# EAGLE design PRY417 Med (EAGLE 9.1.3)
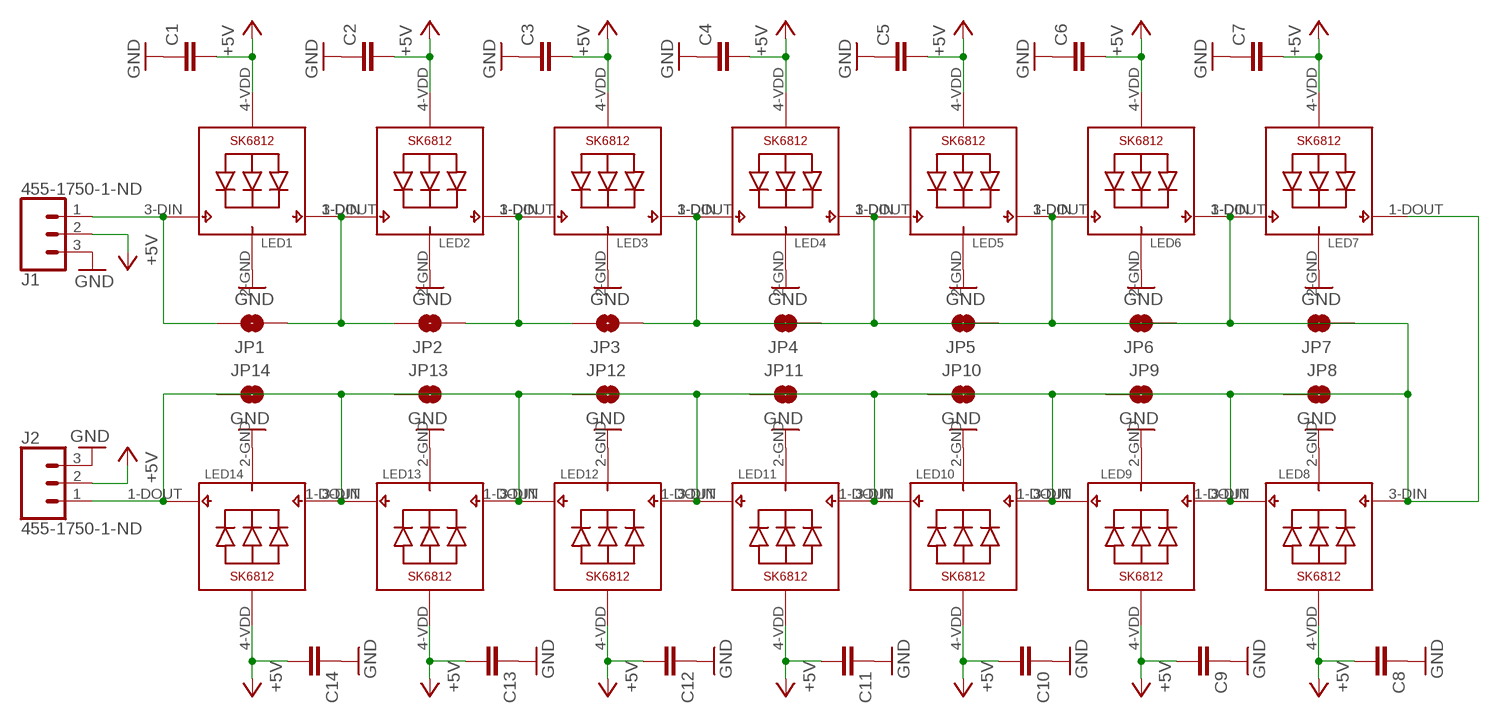
[diagram p0: schematic, sheet 1]

## Parts
C1  C-EUC1206  [C1206]
C2  C-EUC1206  [C1206]
C3  C-EUC1206  [C1206]
C4  C-EUC1206  [C1206]
C5  C-EUC1206  [C1206]
C6  C-EUC1206  [C1206]
C7  C-EUC1206  [C1206]
C8  C-EUC1206  [C1206]
C9  C-EUC1206  [C1206]
C10  C-EUC1206  [C1206]
C11  C-EUC1206  [C1206]
C12  C-EUC1206  [C1206]
C13  C-EUC1206  [C1206]
C14  C-EUC1206  [C1206]
J1  455-1750-1-ND  CONN_03  [1X03]
J2  455-1750-1-ND  CONN_03  [1X03]
JP1  JUMPER-SMT_2_NO_SILK  [SMT-JUMPER_2_NO_SILK]
JP2  JUMPER-SMT_2_NO_SILK  [SMT-JUMPER_2_NO_SILK]
JP3  JUMPER-SMT_2_NO_SILK  [SMT-JUMPER_2_NO_SILK]
JP4  JUMPER-SMT_2_NO_SILK  [SMT-JUMPER_2_NO_SILK]
JP5  JUMPER-SMT_2_NO_SILK  [SMT-JUMPER_2_NO_SILK]
JP6  JUMPER-SMT_2_NO_SILK  [SMT-JUMPER_2_NO_SILK]
JP7  JUMPER-SMT_2_NO_SILK  [SMT-JUMPER_2_NO_SILK]
JP8  JUMPER-SMT_2_NO_SILK  [SMT-JUMPER_2_NO_SILK]
JP9  JUMPER-SMT_2_NO_SILK  [SMT-JUMPER_2_NO_SILK]
JP10  JUMPER-SMT_2_NO_SILK  [SMT-JUMPER_2_NO_SILK]
JP11  JUMPER-SMT_2_NO_SILK  [SMT-JUMPER_2_NO_SILK]
JP12  JUMPER-SMT_2_NO_SILK  [SMT-JUMPER_2_NO_SILK]
JP13  JUMPER-SMT_2_NO_SILK  [SMT-JUMPER_2_NO_SILK]
JP14  JUMPER-SMT_2_NO_SILK  [SMT-JUMPER_2_NO_SILK]
LED1  SK6812_3535  [LED3535]
LED2  SK6812_3535  [LED3535]
LED3  SK6812_3535  [LED3535]
LED4  SK6812_3535  [LED3535]
LED5  SK6812_3535  [LED3535]
LED6  SK6812_3535  [LED3535]
LED7  SK6812_3535  [LED3535]
LED8  SK6812_3535  [LED3535]
LED9  SK6812_3535  [LED3535]
LED10  SK6812_3535  [LED3535]
LED11  SK6812_3535  [LED3535]
LED12  SK6812_3535  [LED3535]
LED13  SK6812_3535  [LED3535]
LED14  SK6812_3535  [LED3535]

## Nets
+5V: C1.2 C2.2 C3.2 C4.2 C5.2 C6.2 C7.2 C8.2 C9.2 C10.2 C11.2 C12.2 C13.2 C14.2 J1.2 J2.2 LED1.4-VDD(VDD) LED2.4-VDD(VDD) LED3.4-VDD(VDD) LED4.4-VDD(VDD) LED5.4-VDD(VDD) LED6.4-VDD(VDD) LED7.4-VDD(VDD) LED8.4-VDD(VDD) LED9.4-VDD(VDD) LED10.4-VDD(VDD) LED11.4-VDD(VDD) LED12.4-VDD(VDD) LED13.4-VDD(VDD) LED14.4-VDD(VDD)
GND: C1.1 C2.1 C3.1 C4.1 C5.1 C6.1 C7.1 C8.1 C9.1 C10.1 C11.1 C12.1 C13.1 C14.1 J1.3 J2.3 LED1.2-GND(GND) LED2.2-GND(GND) LED3.2-GND(GND) LED4.2-GND(GND) LED5.2-GND(GND) LED6.2-GND(GND) LED7.2-GND(GND) LED8.2-GND(GND) LED9.2-GND(GND) LED10.2-GND(GND) LED11.2-GND(GND) LED12.2-GND(GND) LED13.2-GND(GND) LED14.2-GND(GND)
N$1: JP1.2 JP2.1 LED1.1-DOUT(DO) LED2.3-DIN(DI)
N$2: JP2.2 JP3.1 LED2.1-DOUT(DO) LED3.3-DIN(DI)
N$3: JP3.2 JP4.2 LED3.1-DOUT(DO) LED4.3-DIN(DI)
N$4: JP4.1 JP5.2 LED4.1-DOUT(DO) LED5.3-DIN(DI)
N$5: JP5.1 JP6.2 LED5.1-DOUT(DO) LED6.3-DIN(DI)
N$6: JP6.1 JP7.2 LED6.1-DOUT(DO) LED7.3-DIN(DI)
N$7: JP8.1 JP9.2 LED8.1-DOUT(DO) LED9.3-DIN(DI)
N$8: JP9.1 JP10.2 LED9.1-DOUT(DO) LED10.3-DIN(DI)
N$9: JP10.1 JP11.2 LED10.1-DOUT(DO) LED11.3-DIN(DI)
N$10: JP11.1 JP12.2 LED11.1-DOUT(DO) LED12.3-DIN(DI)
N$11: JP12.1 JP13.2 LED12.1-DOUT(DO) LED13.3-DIN(DI)
N$12: JP13.1 JP14.2 LED13.1-DOUT(DO) LED14.3-DIN(DI)
N$13: JP7.1 JP8.2 LED7.1-DOUT(DO) LED8.3-DIN(DI)
N$14: J1.1 JP1.1 LED1.3-DIN(DI)
N$15: J2.1 JP14.1 LED14.1-DOUT(DO)

## Library data of the parts
C1-C14 = rcl:C-EU: CAPACITOR, European symbol; SPICEPREFIX: C
J1 J2 = SparkFun-Connectors:CONN_03: Multi connection point. Often used as Generic Header-pin footprint for 0.1 inch spaced/style header connections On any of the 0.1 inch spaced packages, you can populate with these: Break Away Headers - Straight <https://www.sparkfun.com/products/116> (PRT-00116) Break Away Male Headers - Right Angle <https://www.sparkfun.com/products/553> (PRT-00553) Female Headers <https://www.sparkfun.com/products/115> (PRT-00115) Break Away Headers - Machine Pin <https://www.sparkfun.com/products/117> (PRT-00117) Break Away Female Headers - Swiss Machine Pin <https://www.sparkfun.com/products/743> (PRT-00743) Stackable Header - 3 Pin (Female, 0.1") <https://www.sparkfun.com/products/13875> (PRT-13875) For SCREWTERMINALS and SPRING TERMINALS visit here: Screw Terimnals on SparkFun.com <https://www.sparkfun.com/search/results?term=Screw+Terminals> (5mm/3.5mm/2.54mm spacing) This device is also useful as a general connection point to wire up your design to another part of your project. Our various solder wires solder well into these plated through hole pads. Hook-Up Wire - Assortment (Stranded, 22 AWG) <https://www.sparkfun.com/products/11375> (PRT-11375) Hook-Up Wire - Assortment (Solid Core, 22 AWG) <https://www.sparkfun.com/products/11367> (PRT-11367) View the entire wire category on our website here <https://www.sparkfun.com/categories/141> Special notes: Molex polarized connector foot print use with SKU : PRT-08232 with associated crimp pins and housings.; PROD_ID: XXX-00000
JP1-JP14 = SparkFun-Jumpers:JUMPER-SMT_2_NO: Normally open jumper This jumper has two pads in close proximity to each other. Apply solder to close the connection. Round pads are easier to solder for beginners, but are a lot larger. SparkFun Product that uses the round pads: SparkFun EL Sequencer <https://www.sparkfun.com/products/12781>
LED1-LED14 = SK6812:SK6812

## Board
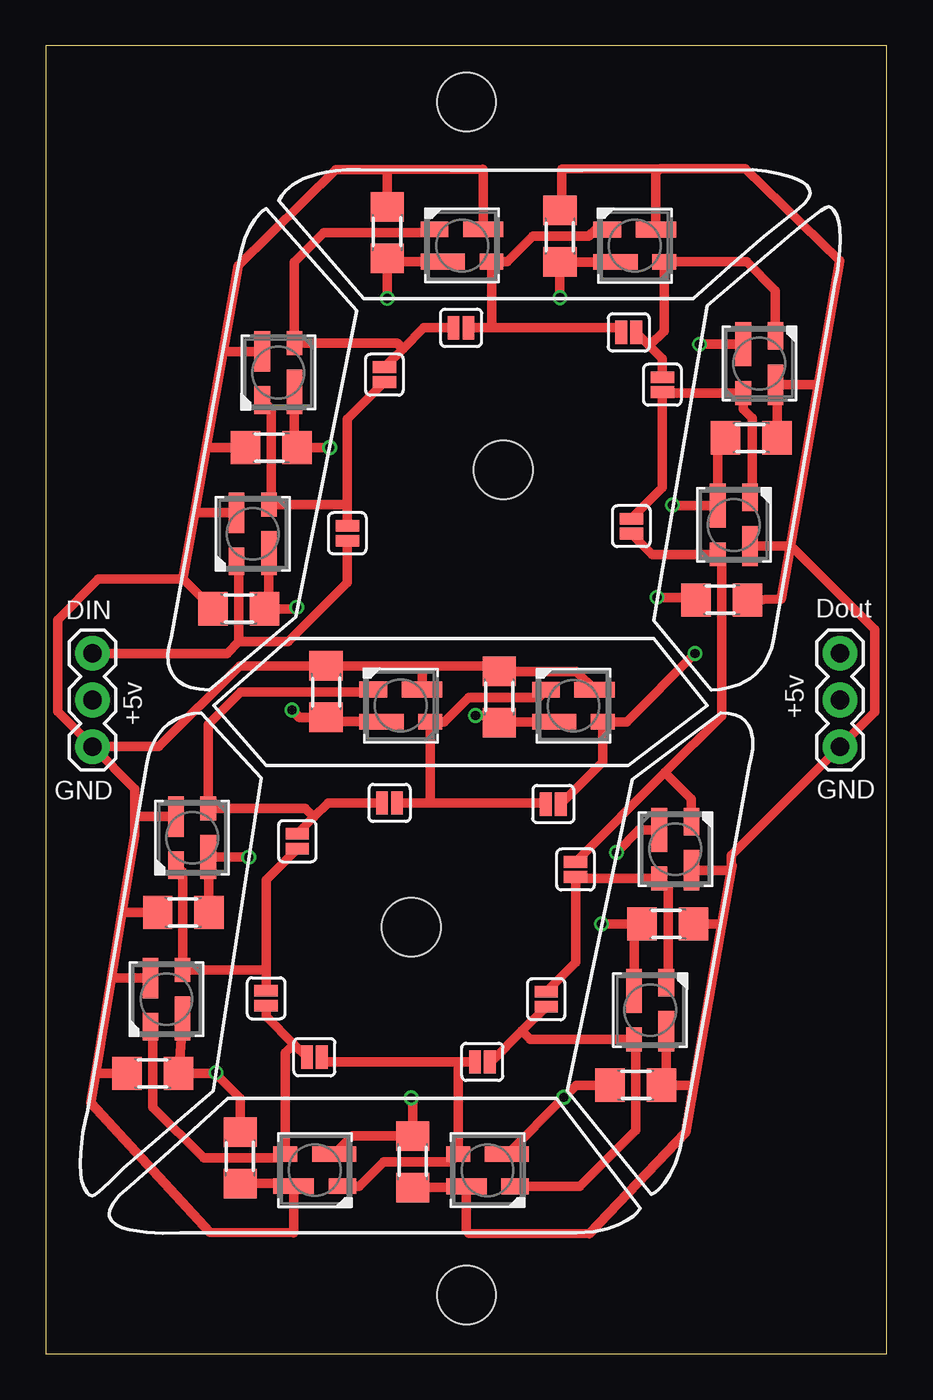
[diagram p1: board, top side]
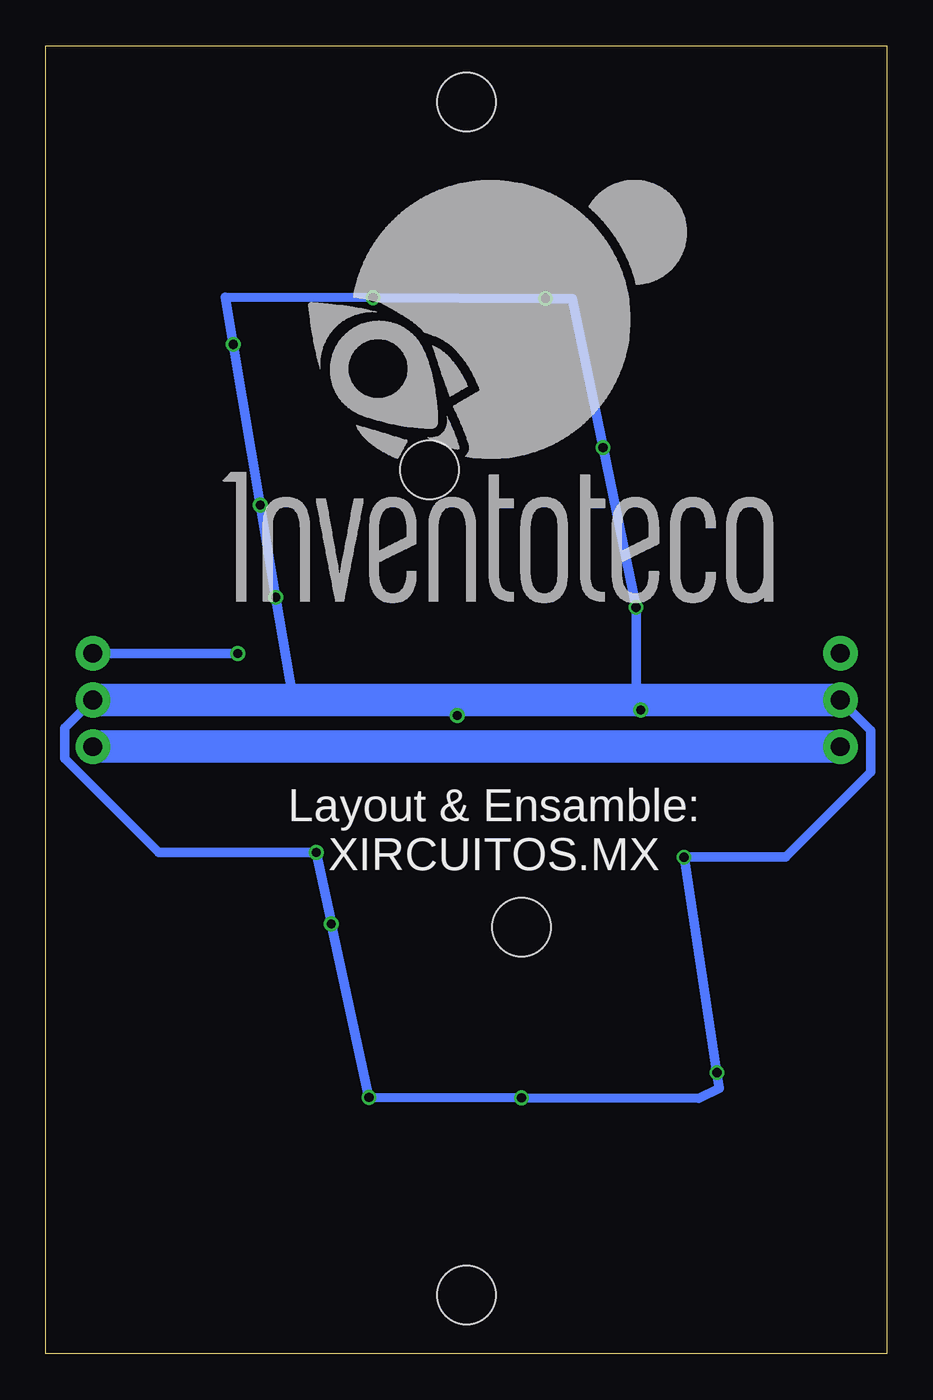
[diagram p2: board, bottom side, seen from below]

Size 45.72 x 71.12 mm. Coordinates in mm from the lower left corner, seen from the top.
Outline: 0,0 45.72,0 45.72,71.12 0,71.12 0,0
Copper layers (1*16): Top 0.035mm / dielectric 1.5mm / Bottom 0.035mm
Design rules "_xircuitos.mx_2L_DRC": minimum track width 6mil, minimum drill 12mil, track to track 6mil, track to pad 6mil, pad to pad 6mil, via to via 6mil, smd to smd 0mil, copper to edge 10mil, drill to drill 12mil, minimum pad ring 10mil, minimum via ring 6mil, stop-mask expansion 2mil, vias tented up to drill 100mil, thermal gap 10mil
Holes 3.2 mm at 22.86,68.07 22.86,3.18 19.86,23.18 24.86,48.07

### Footprints (pad centres in the part's own frame; a part is rotated, then mirrored left to right if it is on the bottom)
C1206 = smd 1.6 x 1.8: 1 -1.4,0; 2 1.4,0
1X03 = drill 1.016 pad 1.88: 1 0,0; 2 2.54,0; 3 5.08,0
SMT-JUMPER_2_NO_SILK = smd 0.635 x 1.27: 1 -0.406,0; 2 0.406,0
LED3535 = smd 1.3 x 0.85: 1-DOUT 1.6,-0.875 | smd 2.2 x 0.85: 2-GND 1.15,0.875 | smd 1.5 x 0.85: 3-DIN -1.5,0.875 | smd 2.4 x 0.85: 4-VDD -1.05,-0.875

### Placement (x,y rotation side)
C1  10.49,40.51 0 top
C2  12.24,49.27 0 top
C3  18.55,60.97 270 top
C4  27.95,60.76 270 top
C5  38.35,49.81 180 top
C6  36.73,40.99 180 top
C7  33.81,23.36 180 top
C8  32.07,14.6 180 top
C9  19.94,10.43 90 top
C10  10.56,10.65 90 top
C11  5.81,15.24 0 top
C12  7.48,24 0 top
C13  15.22,36.01 270 top
C14  24.64,35.7 270 top
J1  2.53,38.09 270 top
J2  43.17,38.09 270 top
JP1  16.39,44.62 90 top
JP2  18.4,53.24 90 top
JP3  22.57,55.79 0 top
JP4  31.69,55.53 180 top
JP5  33.52,52.69 90 top
JP6  31.83,45 90 top
JP7  28.8,26.33 90 top
JP8  27.2,19.27 90 top
JP9  23.73,15.87 0 top
JP10  14.59,16.12 0 top
JP11  11.97,19.32 270 top
JP12  13.66,27.86 270 top
JP13  18.68,29.94 180 top
JP14  27.58,29.88 180 top
LED1  11.24,44.58 90 top
LED2  12.64,53.36 90 top
LED3  22.62,60.26 0 top
LED4  32.02,60.25 0 top
LED5  38.79,53.84 270 top
LED6  37.4,45.07 270 top
LED7  34.22,27.43 270 top
LED8  32.85,18.68 270 top
LED9  24.01,9.97 180 top
LED10  14.62,9.98 180 top
LED11  6.55,19.28 90 top
LED12  7.95,28.05 90 top
LED13  19.29,35.24 0 top
LED14  28.68,35.24 0 top

### Tracks (layer width: path | path; a pad name or v marks a point on that pad's centre or on a via)
+5V  (via drill 0.5)
  Top 0.508: v11.03,27 v11.02,27 LED12.4-VDD C12.2 | LED11.4-VDD C11.2 9.2,15.24 | 9.2,15.24 v9.24,15.28 | C10.2 10.56,13.88 9.2,15.24 | v19.86,13.91 19.94,13.83 C9.2 16.65,11.83 LED10.4-VDD | C8.2 28.82,14.6 v28.16,13.93 25.07,10.85 LED9.4-VDD | LED8.4-VDD 31.98,22.93 C7.2 v30.22,23.36 v30.21,23.37 | LED7.4-VDD 32.24,28.48 v31.02,27.27 v31.02,27.26 | LED1.4-VDD 12.12,40.74 C1.2 13.55,40.51 v13.63,40.59 | LED2.4-VDD 13.51,49.4 C2.2 v15.43,49.27 | LED3.4-VDD 18.73,59.39 C3.2 18.55,57.4 v18.56,57.38 | LED4.4-VDD 30.95,59.36 C4.2 v27.95,57.43 v27.94,57.43 | C5.2 36.53,49.39 LED6.4-VDD 34.1,46.12 v34.07,46.15 | LED5.4-VDD v35.54,54.9 v35.54,54.89 | C6.2 35.2,41.13 v33.23,41.13 | LED13.4-VDD 15.46,34.37 C13.2 13.78,34.61 v13.38,35.01 | LED14.4-VDD 24.69,34.36 C14.2 24.23,34.71 v23.36,34.71
  Bottom 0.508: 32.29,35.55 v33.23,41.13 v34.07,46.15 v35.54,54.89 35.97,57.47 v27.94,57.43 v18.56,57.38 17.1,57.38 v15.43,49.27 v13.63,40.59 13.63,35.6 13.69,35.55 13.69,35.31 v13.38,35.01 | v23.36,34.71 23.48,34.83 23.48,35.55 | J2.2 44.7,34.02 44.7,32.37 39.59,27.26 v31.02,27.26 30.21,23.51 v30.21,23.37 v28.16,13.93 v19.86,13.91 10.23,13.88 9.11,14.42 v9.24,15.28 v11.03,27 5.5,27 0.88,31.62 0.88,33.9 J1.2
  Bottom 1.778: J1.2 13.69,35.55 23.48,35.55 32.29,35.55 J2.2
GND
  Top 0.508: 4.14,24.06 4.82,28.2 4.82,29.22 | 4.14,24.06 3.54,20.37 | 3.54,20.37 2.7,15.24 | 2.7,15.24 2.44,13.64 8.91,6.58 13.45,6.56 13.47,6.58 LED10.2-GND 13.32,9.25 C10.1 | 35.22,14.56 34.78,12.03 29.53,6.5 23,6.53 22.86,6.67 LED9.2-GND 22.8,9.03 C9.1 | 35.22,14.56 36.75,23.33 | 36.75,23.33 37.27,26.29 | 37.27,26.29 37.31,26.55 | C7.1 36.72,23.36 36.75,23.33 | 35.22,14.56 35.19,14.6 C8.1 33.73,14.85 LED8.2-GND | C11.1 2.7,15.24 | 5.67,23.6 C12.1 4.2,24 4.14,24.06 | LED11.2-GND 3.59,20.43 3.54,20.37 | C1.1 7.46,42.13 | 7.46,42.13 7.45,42.13 8.08,45.74 | 8.08,45.74 8.74,49.47 | 8.74,49.47 9.63,54.52 | 9.63,54.52 10.44,59.16 15.76,64.39 18.55,64.4 | 18.55,64.4 23.75,64.41 23.77,64.39 LED3.2-GND | 33.39,64.43 28.05,64.42 28.05,62.27 C4.1 | 33.39,64.43 38.02,64.44 43.16,59.44 41.99,52.66 | 41.99,52.66 40.43,43.71 | 40.43,43.71 39.98,41.05 C6.1 | LED1.2-GND 8.09,45.73 8.08,45.74 | C2.1 8.93,49.27 8.74,49.47 | LED2.2-GND 9.64,54.51 9.63,54.52 | C3.1 18.55,64.39 18.55,64.4 | LED4.2-GND 33.17,64.21 33.39,64.43 | 41.99,52.66 41.95,52.7 LED5.2-GND 39.75,52.61 C5.1 | LED6.2-GND 40.22,43.92 | 40.22,43.92 40.43,43.71 | 20.65,37.41 C13.1 10.53,37.41 6.13,33.01 J1.3 | 20.65,37.41 24.33,37.41 C14.1 28.84,37.1 LED14.2-GND | LED13.2-GND 20.45,37.2 20.65,37.41 | LED7.2-GND 37.26,26.28 37.27,26.29 | 4.82,29.22 4.82,30.72 J1.3 | 4.82,29.22 4.83,29.2 LED12.2-GND | 37.27,26.29 37.27,27.1 J2.3 45.07,34.9 45.07,39.37 40.48,43.97 40.43,43.92 40.22,43.92 | J1.3 0.63,34.91 0.63,39.91 2.85,42.13 7.46,42.13
  Bottom 1.778: J1.3 5,33.01 6.3,33.01 J2.3
N$1
  Top 0.508: JP2.1 16.39,50.82 16.39,46.23 | 16.39,46.23 JP1.2 | 16.39,46.23 16.34,46.18 LED1.1-DOUT 12.25,46.31 12.25,51.37 LED2.3-DIN
N$2
  Top 0.508: JP2.2 19.41,54.66 | 19.41,54.66 20.55,55.79 JP3.1 | 19.41,54.66 19.11,54.96 LED2.1-DOUT 13.51,59.37 15.11,60.98 20.96,60.98 LED3.3-DIN
N$3
  Top 0.508: JP3.2 24.23,55.79 | 24.23,55.79 31.02,55.79 JP4.2 | 24.23,55.79 24.22,55.8 LED3.1-DOUT 25.08,59.39 26.45,60.76 29.52,60.76 29.89,61.13 LED4.3-DIN
N$4
  Top 0.508: JP4.1 32.81,54.81 | 32.81,54.81 33.52,54.11 JP5.2 | 32.81,54.81 33.62,55.62 LED4.1-DOUT 38.1,59.38 39.66,57.82 LED5.3-DIN
N$5
  Top 0.508: JP6.2 33.52,47.09 JP5.1 33.56,52.24 LED5.1-DOUT 37.91,51.37 38.4,50.88 38.4,46.69 LED6.3-DIN
N$6
  Top 0.508: JP6.1 32.95,43.47 LED6.1-DOUT 36.74,43.26 36.74,35.28 36.74,34.68 33.66,31.59 | JP7.2 33.66,31.59 | LED7.3-DIN 35.1,30.15 33.66,31.59
N$7
  Top 0.508: JP8.1 25.88,17.54 | 25.88,17.54 24.2,15.87 JP9.2 | LED9.3-DIN 29.02,9.1 32.06,12.14 32.06,16.99 LED8.1-DOUT 26.34,17.08 25.88,17.54
N$8
  Top 0.508: JP9.1 22.42,15.87 | 22.42,15.87 15.26,15.87 JP10.2 | LED10.3-DIN 17.04,9.1 18.35,10.42 21.98,10.42 LED9.1-DOUT 22.41,15.86 22.42,15.87
N$9
  Top 0.508: JP10.1 13.48,16.82 | 13.48,16.82 11.97,18.34 JP11.2 | 13.48,16.82 13.02,16.36 LED10.1-DOUT 12.81,10.64 8.56,10.64 5.81,13.4 5.81,17.64 LED11.3-DIN
N$10
  Top 0.508: JP11.1 11.97,20.85 | 11.97,20.85 11.97,25.77 JP12.2 | LED12.3-DIN 7.42,26.2 LED11.1-DOUT 11.94,20.88 11.97,20.85
N$11
  Top 0.508: JP12.1 14.57,29.18 | 14.57,29.18 15.33,29.94 JP13.2 | 14.57,29.18 14.1,29.65 LED12.1-DOUT 8.82,34.22 10.59,35.99 17.66,35.99 LED13.3-DIN
N$12
  Top 0.508: JP13.1 20.91,29.94 | 20.91,29.94 27.12,29.94 JP14.2 | 20.91,29.94 20.89,29.96 LED13.1-DOUT 20.91,34.36 21.65,34.36 22.98,35.69 26.76,35.69 LED14.3-DIN
N$13
  Top 0.508: JP8.2 28.8,21.27 JP7.1 28.89,25.83 LED7.1-DOUT 33.83,25.35 33.83,20.28 LED8.3-DIN
N$14
  Top 0.508: J1.1 9.85,38.09 10.48,38.72 | LED1.3-DIN 10.48,42.97 10.48,38.72 | JP1.1 16.39,41.94 13.18,38.74 10.51,38.74 10.48,38.72
N$15  (via drill 0.5)
  Top 0.508: JP14.1 30.28,32.17 LED14.1-DOUT 31.57,34.36 v35.29,38.08
  Bottom 0.508: v35.29,38.08 J2.1

### Text on the board
tPlace: DIN | Dout | +5v | +5v | GND | GND
bPlace: Layout & Ensamble: / XIRCUITOS.MX